# Altium schematic sheet Sheet1.SchDoc
size A4; CompanyName: Ultimaker; Revision: rev. 2.1.2
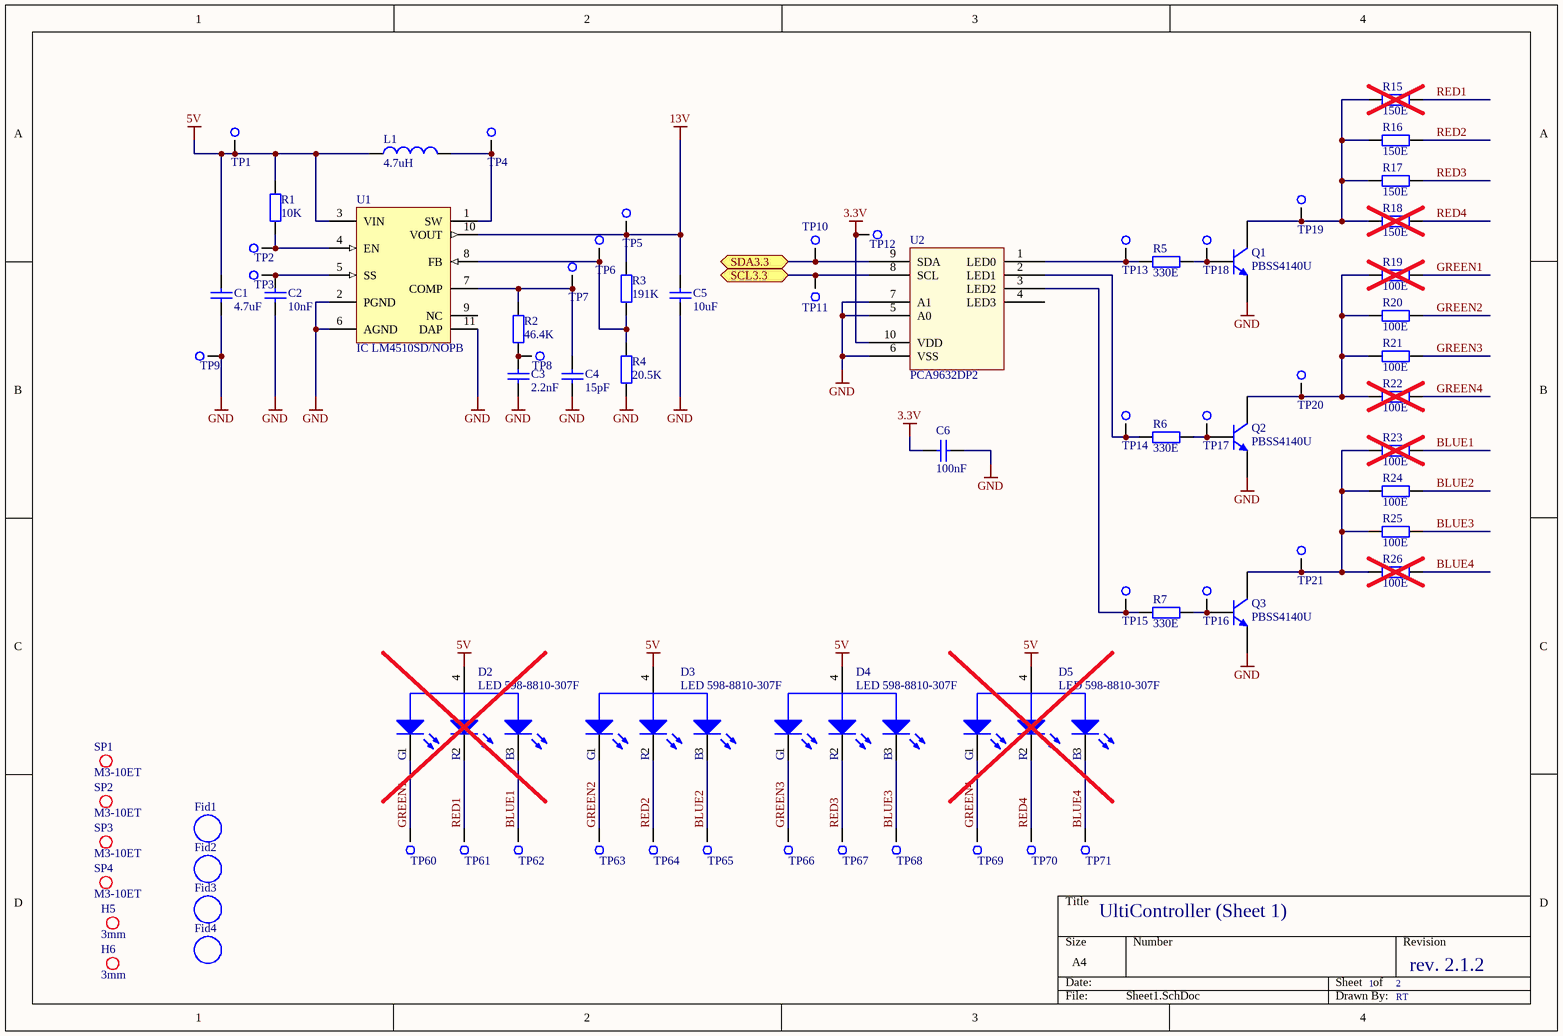
[diagram p0: Sheet1.SchDoc]

## Parts
C1  4.7uF  [C1206 (3216)]
C2  10nF  [C0805 (2012)]
C3  2.2nF  [C0805 (2012)]
C4  15pF  [C0805 (2012)]
C5  10uF  [C1206 (3216)]
C6  100nF  [C0805 (2012)]
D2  LED 598-8810-307F  [LED SMD  598-8810-307F]  (no BOM)
D3  LED 598-8810-307F  [LED SMD  598-8810-307F]
D4  LED 598-8810-307F  [LED SMD  598-8810-307F]
D5  LED 598-8810-307F  [LED SMD  598-8810-307F]  (no BOM)
Fid1  Fiducial  [Fiducial 1,5mm]  (value not drawn)  (no BOM)
Fid2  Fiducial  [Fiducial 1,5mm]  (value not drawn)  (no BOM)
Fid3  Fiducial  [Fiducial 1,5mm]  (value not drawn)  (no BOM)
Fid4  Fiducial  [Fiducial 1,5mm]  (value not drawn)  (no BOM)
H5  3mm  [Mounting Hole 3mm PTH]  (no BOM)
H6  3mm  [Mounting Hole 3mm PTH]  (no BOM)
L1  4.7uH  [Inductor MCSDC0604]
Q1  PBSS4140U  [IC SOT323]
Q2  PBSS4140U  [IC SOT323]
Q3  PBSS4140U  [IC SOT323]
R1  10K  [R0805 (2012)]
R2  46.4K  [R0805 (2012)]
R3  191K  [R0805 (2012)]
R4  20.5K  [R0805 (2012)]
R5  330E  [R0805 (2012)]
R6  330E  [R0805 (2012)]
R7  330E  [R0805 (2012)]
R15  150E  [R0805 (2012)]  (no BOM)
R16  150E  [R0805 (2012)]
R17  150E  [R0805 (2012)]
R18  150E  [R0805 (2012)]  (no BOM)
R19  100E  [R0805 (2012)]  (no BOM)
R20  100E  [R0805 (2012)]
R21  100E  [R0805 (2012)]
R22  100E  [R0805 (2012)]  (no BOM)
R23  100E  [R0805 (2012)]  (no BOM)
R24  100E  [R0805 (2012)]
R25  100E  [R0805 (2012)]
R26  100E  [R0805 (2012)]  (no BOM)
SP1  M3-10ET  [Spacer M3-10ET]
SP2  M3-10ET  [Spacer M3-10ET]
SP3  M3-10ET  [Spacer M3-10ET]
SP4  M3-10ET  [Spacer M3-10ET]
TP1  2mm  [TESTPOINT 2mm]  (value not drawn)  (no BOM)
TP2  2mm  [TESTPOINT 2mm]  (value not drawn)  (no BOM)
TP3  2mm  [TESTPOINT 2mm]  (value not drawn)  (no BOM)
TP4  2mm  [TESTPOINT 2mm]  (value not drawn)  (no BOM)
TP5  2mm  [TESTPOINT 2mm]  (value not drawn)  (no BOM)
TP6  2mm  [TESTPOINT 2mm]  (value not drawn)  (no BOM)
TP7  2mm  [TESTPOINT 2mm]  (value not drawn)  (no BOM)
TP8  2mm  [TESTPOINT 2mm]  (value not drawn)  (no BOM)
TP9  2mm  [TESTPOINT 2mm]  (value not drawn)  (no BOM)
TP10  2mm  [TESTPOINT 2mm]  (value not drawn)  (no BOM)
TP11  2mm  [TESTPOINT 2mm]  (value not drawn)  (no BOM)
TP12  2mm  [TESTPOINT 2mm]  (value not drawn)  (no BOM)
TP13  2mm  [TESTPOINT 2mm]  (value not drawn)  (no BOM)
TP14  2mm  [TESTPOINT 2mm]  (value not drawn)  (no BOM)
TP15  2mm  [TESTPOINT 2mm]  (value not drawn)  (no BOM)
TP16  2mm  [TESTPOINT 2mm]  (value not drawn)  (no BOM)
TP17  2mm  [TESTPOINT 2mm]  (value not drawn)  (no BOM)
TP18  2mm  [TESTPOINT 2mm]  (value not drawn)  (no BOM)
TP19  2mm  [TESTPOINT 2mm]  (value not drawn)  (no BOM)
TP20  2mm  [TESTPOINT 2mm]  (value not drawn)  (no BOM)
TP21  2mm  [TESTPOINT 2mm]  (value not drawn)  (no BOM)
TP60  2mm  [TESTPOINT 2mm]  (value not drawn)  (no BOM)
TP61  2mm  [TESTPOINT 2mm]  (value not drawn)  (no BOM)
TP62  2mm  [TESTPOINT 2mm]  (value not drawn)  (no BOM)
TP63  2mm  [TESTPOINT 2mm]  (value not drawn)  (no BOM)
TP64  2mm  [TESTPOINT 2mm]  (value not drawn)  (no BOM)
TP65  2mm  [TESTPOINT 2mm]  (value not drawn)  (no BOM)
TP66  2mm  [TESTPOINT 2mm]  (value not drawn)  (no BOM)
TP67  2mm  [TESTPOINT 2mm]  (value not drawn)  (no BOM)
TP68  2mm  [TESTPOINT 2mm]  (value not drawn)  (no BOM)
TP69  2mm  [TESTPOINT 2mm]  (value not drawn)  (no BOM)
TP70  2mm  [TESTPOINT 2mm]  (value not drawn)  (no BOM)
TP71  2mm  [TESTPOINT 2mm]  (value not drawn)  (no BOM)
U1  IC LM4510SD/NOPB  [IC SDA10A]
U2  PCA9632DP2  [IC TSSOP-10]

## Ports
SCL3.3 (bidir), SDA3.3 (bidir)

## Nets
3.3V: C6.1 TP12.1 U2.10(VDD)
5V: C1.2 D2.4 D3.4 D4.4 D5.4 L1.1 R1.2 TP1.1 U1.3(VIN)
13V: C5.2 R3.2 TP5.1 U1.10(VOUT)
GND: C1.1 C2.1 C3.1 C4.1 C5.1 C6.2 Q1.2(E) Q2.2(E) Q3.2(E) R4.1 TP9.1 U1.2(PGND) U1.6(AGND) U1.11(DAP) U2.5(A0) U2.6(VSS) U2.7(A1)
BLUE1: D2.3 R23.2 TP62.1
BLUE2: D3.3 R24.2 TP65.1
BLUE3: D4.3 R25.2 TP68.1
BLUE4: D5.3 R26.2 TP71.1
GREEN1: D2.1 R19.2 TP60.1
GREEN2: D3.1 R20.2 TP63.1
GREEN3: D4.1 R21.2 TP66.1
GREEN4: D5.1 R22.2 TP69.1
RED1: D2.2 R15.2 TP61.1
RED2: D3.2 R16.2 TP64.1
RED3: D4.2 R17.2 TP67.1
RED4: D5.2 R18.2 TP70.1
SCL3.3: TP11.1 U2.8(SCL) ; port SCL3.3
SDA3.3: TP10.1 U2.9(SDA) ; port SDA3.3
NetC2_2: C2.2 TP3.1 U1.5(SS)
NetC3_2: C3.2 R2.1 TP8.1
NetC4_2: C4.2 R2.2 TP7.1 U1.7(COMP)
NetL1_2: L1.2 TP4.1 U1.1(SW)
NetQ1_1: Q1.1(B) R5.2 TP18.1
NetQ1_3: Q1.3(C) R15.1 R16.1 R17.1 R18.1 TP19.1
NetQ2_1: Q2.1(B) R6.2 TP17.1
NetQ2_3: Q2.3(C) R19.1 R20.1 R21.1 R22.1 TP20.1
NetQ3_1: Q3.1(B) R7.2 TP16.1
NetQ3_3: Q3.3(C) R23.1 R24.1 R25.1 R26.1 TP21.1
NetR1_1: R1.1 TP2.1 U1.4(EN)
NetR3_1: R3.1 R4.2 TP6.1 U1.8(FB)
NetR5_1: R5.1 TP13.1 U2.1(LED0)
NetR6_1: R6.1 TP14.1 U2.2(LED1)
NetR7_1: R7.1 TP15.1 U2.3(LED2)

Not connected (* = marked no-connect by the designer): U1 9(NC); U2 4(LED3)

## Notes on the sheet
- UltiController (Sheet 1)
- 1
- 2
- rev. 2.1.2
- RT
- (in symbol LED 598-8810-307F) G; R; B

## Library data of the parts
C1 = Cap 4.7uF X7R 1206: Cap 4.7uF 1206 X7R 10% 25V; Mfg: TDK; Mfg code: C3216X7R1E475K160AC; Faber ItemCode: -; Max soldering temp: -; Remarks: -; Supplier: Farnell; Supplier code: 1907356; Value: 4.7uF; SMD: Yes
C2 = Cap 10nF X7R 0805: Cap 10nF X7R 0805 10% 100V; Mfg: AVX; Mfg code: 08051C103K4Z2A; Faber ItemCode: -; Max soldering temp: -; Remarks: -; Supplier: Farnell; Supplier code: 1833850; SMD: Yes; Value: 10nF
C3 = Cap 2.2nF X7R 0805: Cap 2.2nF X7R 0805 10% 100V; Mfg: KEMET; Mfg code: C0805F222K1RACAUTO; Faber ItemCode: -; Max soldering temp: -; Remarks: -; Supplier: Farnell; Supplier code: 1869056; Value: 2.2nF; SMD: Yes
C4 = Cap 15pF NPO 0805: Cap 15pF NPO 0805 5% 100V; Mfg: AVX; Mfg code: 08051A150JAT2A; Faber ItemCode: -; Max soldering temp: -; Remarks: -; Supplier: Farnell; Supplier code: 1658873; Value: 15pF; SMD: Yes
C5 = Cap 10uF X7R 1206: Cap 10uF 1206 X7R 10% 25V; Mfg: KEMET; Mfg code: C1206C106K3RAC TU; Faber ItemCode: -; Max soldering temp: -; Remarks: -; Supplier: Farnell; Supplier code: 2118134; Value: 10uF; SMD: Yes
C6 = Cap 100nF X7R 0805: Cap 100nF X7R 0805 10% 100V; Mfg: AVX; Mfg code: 08051C104K4T2A; Faber ItemCode: -; Max soldering temp: -; Remarks: -; Supplier: Farnell; Supplier code: 1833888; Value: 100nF; SMD: Yes
D2-D5 = LED 598-8810-307F: LED MULTICOLOR RED/GRN/BLUE 1208; Mfg: DIALIGHT; Bestel grote: 1; Prijs: 2.26; Mfg code: 598-8810-307F; Faber itemcode: -; Supplier: Farnell; Supplier code: 1850760; Remarks: -; Value: -; Max soldering temp: -; SMD: Yes; Faber Artikelomschrijving: -
Fid1-Fid4 = Fiducial: Remarks: Not a component; Faber ItemCode: -; Mfg: -; Mfg code: -; Value: -; Supplier: -; Supplier code: -; Max soldering temp: -
H5 H6 = Mounting Hole 3mm PTH: Remarks: Not a component; Faber ItemCode: -; Mfg: -; Mfg code: -; Value: -; Supplier: -; Supplier code: -; Max soldering temp: -
L1 = Inductor 4.7uH SMD: Mfg: MULTICOMP; Mfg code: MCSDC0604-4R7MU; Faber ItemCode: -; Max soldering temp: -; Remarks: -; SMD: Yes; Supplier: Farnell; Supplier code: 1864164RL; Value: 4.7uH
Q1-Q3 = NPN PBSS4140U: NPN PBSS4140U SOT-323 1A; Mfg: NXP; Faber ItemCode: -; Max soldering temp: -; Mfg code: PBSS4140U; Remarks: -; Supplier: Farnell; Supplier code: 8736197; Value: -; SMD: Yes
R1 = Res 10K 0805: Res 10K 0805 1% 100mW; Mfg: MULTICOMP; Mfg code: MC 0.1W 0805 1% 10K; Faber ItemCode: -; Max soldering temp: -; Remarks: -; Supplier: Farnell; Supplier code: 9332391; Value: 10K; SMD: Yes
R2 = Res 46.4K 0805: Res 46.4K 0805 1% 100mW; Mfg: MULTICOMP; Mfg code: MC0.1W08051%46K4; Faber ItemCode: -; Max soldering temp: -; Remarks: -; Supplier: Farnell; Supplier code: 2141881RL; Value: 46.4K; SMD: Yes
R3 = Res 191K 0805: Res 191K 0805 1% 125mW; Mfg: VISHAY DRALORIC; Mfg code: CRCW0805191KFKEA; Faber ItemCode: -; Max soldering temp: -; Remarks: -; Supplier: Farnell; Supplier code: 2139049; Value: 191K; SMD: Yes
R4 = Res 20.5K 0805: Res 20.5K 0805 1% 100mW; Mfg: MULTICOMP; Mfg code: MC0.1W08051%20K5; Faber ItemCode: -; Max soldering temp: -; Remarks: -; Supplier: Farnell; Supplier code: 2141862RL; Value: 20.5K; SMD: Yes
R5-R7 = Res 330E 0805: Res 330E 0805 1% 100mW; Mfg: MULTICOMP; Mfg code: MC 0.1W 0805 1% 330R; Faber ItemCode: -; Max soldering temp: -; Remarks: -; Supplier: Farnell; Supplier code: 9333037; Value: 330E; SMD: Yes
R15-R18 = Res 150E 0805: Res 150E 0805 1% 125mW; Faber ItemCode: 31224600; Mfg: YAGEO; Mfg code: 2322 734 61501; Faber Artikelomschrijving: RES 150E 1% 0,125W 0805; Bestel grote: 5000; Prijs: 0,0012; Max soldering temp: -; Remarks: -; Supplier: AVNET Abacus; Supplier code: 2322 734 61501; Value: 150E; SMD: Yes
R19-R26 = Res 100E 0805: Res 100E 0805 1% 125mW; Faber ItemCode: 31560100; Mfg: YAGEO; Mfg code: WRC31022/ RC0805FR-07100RL; Faber Artikelomschrijving: RES 100E 1% 0,125W 0805; Bestel grote: 5000; Prijs: 0,0009; Max soldering temp: -; Remarks: -; Supplier: Rutronik; Supplier code: WRC31022/ RC0805FR-07100RL; Value: 100E; SMD: Yes
SP1-SP4 = Spacer M3-10ET: Spacer SMTSO-M3-10ET; Faber ItemCode: 36462900; Mfg: PEM; Faber Artikelomschrijving: MOER-SMD SMTSO-M3-10ET  PEM; Bestel grote: 300; Prijs: 0.4311; Mfg code: SMTSO-M3-10ET; Value: -; Remarks: -; Supplier: Onkenhout & Onkenhout; Supplier code: SMTSO-M3-10ET; Max soldering temp: -; SMD: Yes
TP1-TP21 TP60-TP71 = Testpoint, 2mm, round: Remarks: Not a component; Faber ItemCode: -; Mfg: -; Mfg code: -; Value: -; Supplier: -; Supplier code: -; Max soldering temp: -
U1 = IC LM4510SD/NOPB: IC Synchronous Step-Up DC/DC Converter with True Shutdown Isolation, 10-pin LLP, Pb-Free; Faber ItemCode: 36966700; Mfg: TEXAS INSTRUMENTS; Faber Artikelomschrijving: IC LM4510SD/NOPB LLP-10 TI; Bestel grote: 1; Prijs: 1,10; Max soldering temp: -; Mfg code: LM4510SD/NOPB; Remarks: -; SMD: Yes; Supplier: Digikey; Supplier code: LM4510SD/NOPBDKR-ND; Value: -
U2 = IC PCA9632: IC LED DRIVER RGBA; Faber ItemCode: 36966800; Mfg: NXP; Faber Artikelomschrijving: IC PCA9632DP2 TSSOP-10 NXP; Bestel grote: 1000; Prijs: 1,0876; Max soldering temp: -; Mfg code: PCA9632DP2; Remarks: -; SMD: Yes; Supplier: Digikey; Supplier code: 568-8254-6-ND; Value: -